# Altium schematic sheet Microcontroller.SchDoc
size A2; SheetNumber: 1; SheetTotal: 4
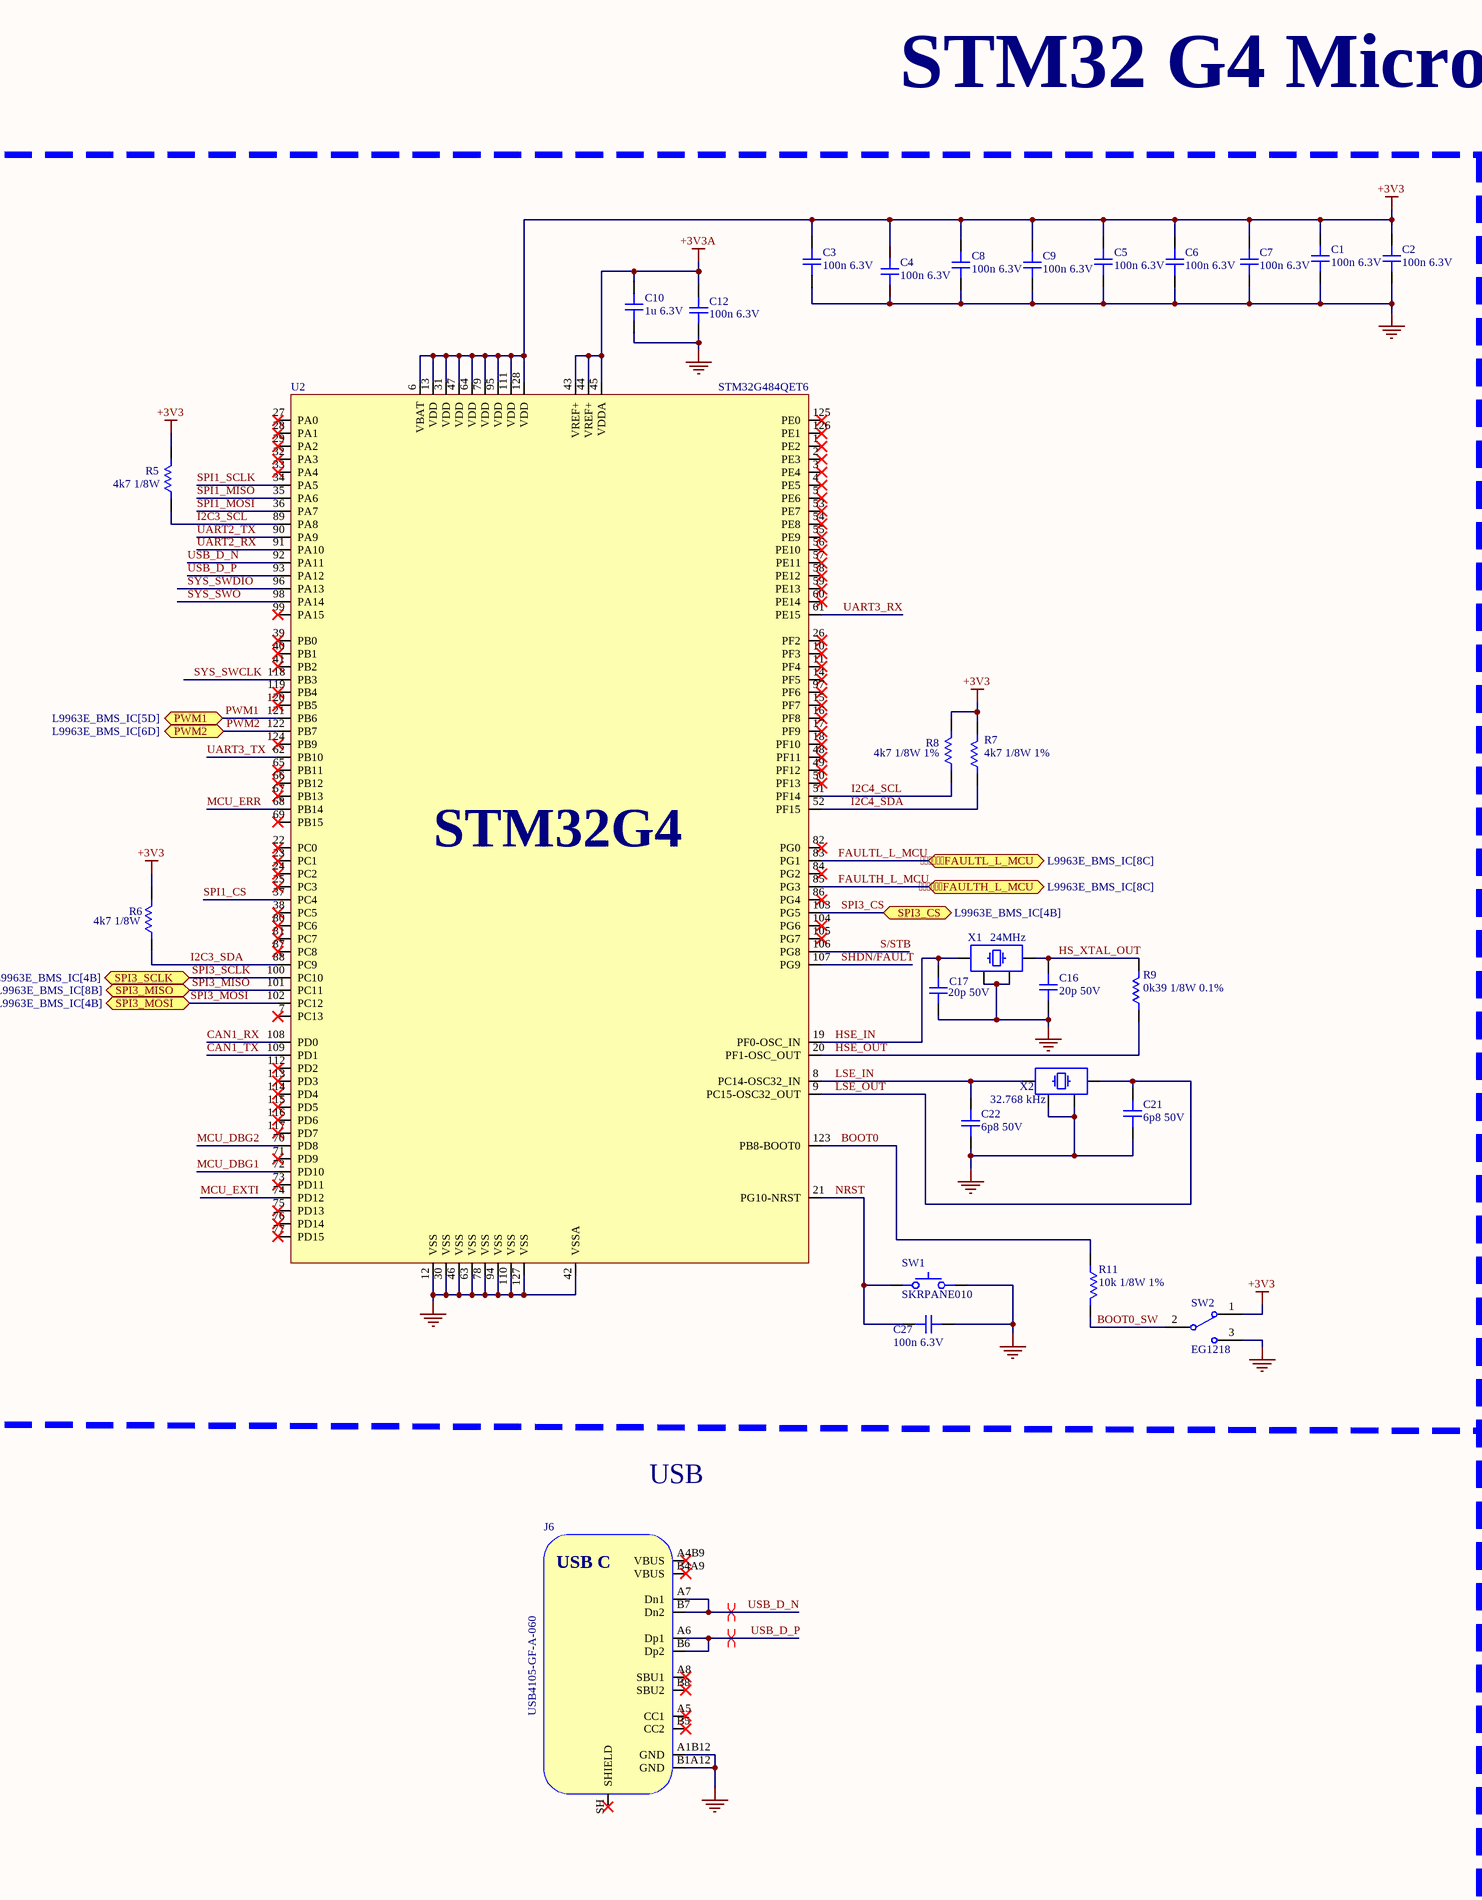
[diagram p0: Microcontroller.SchDoc, left]
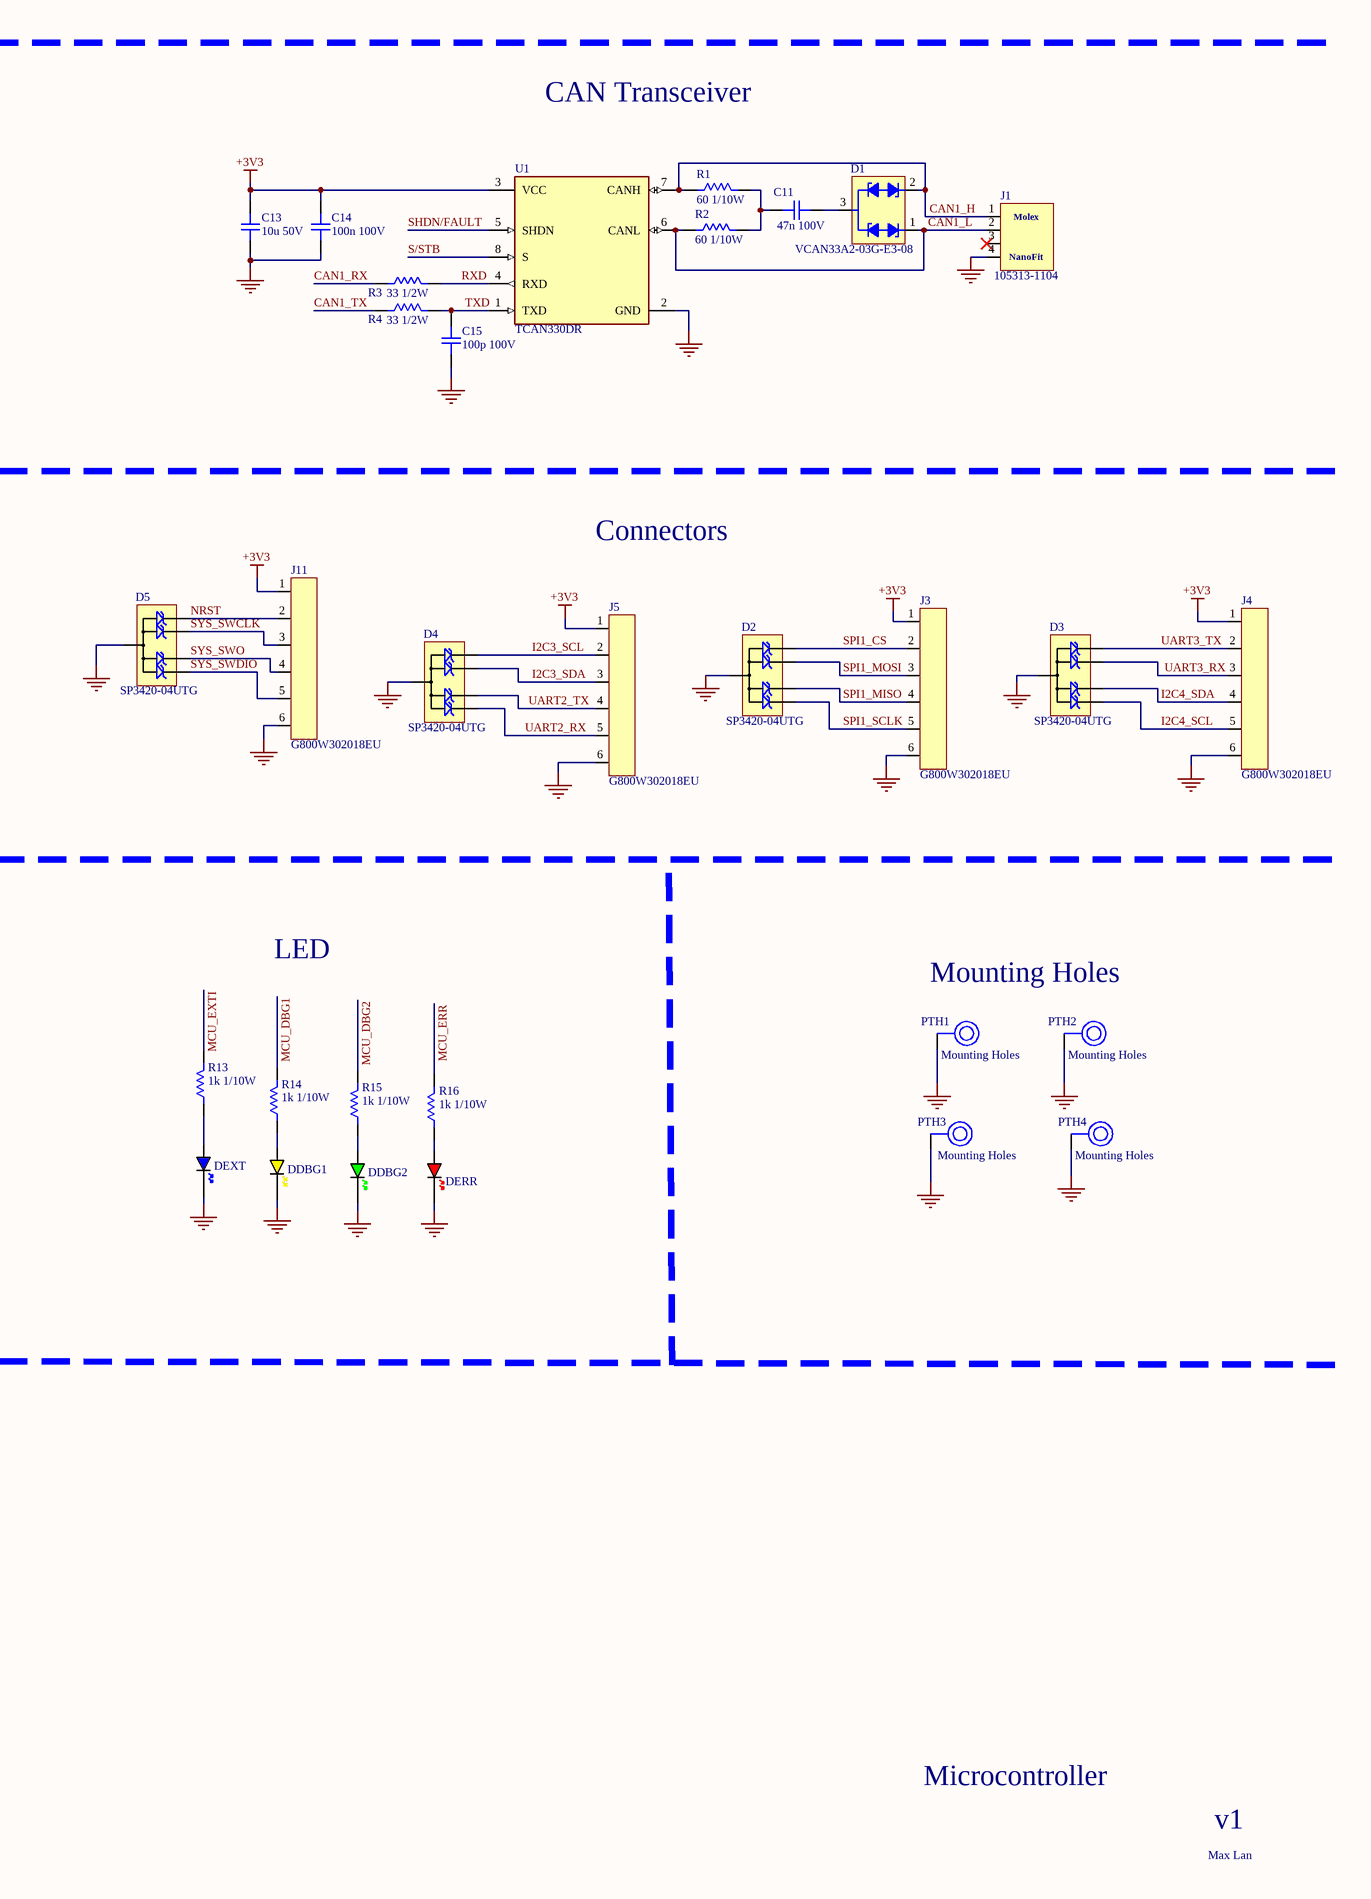
[diagram p1: Microcontroller.SchDoc, right]

## Parts
C1  100n 6.3V  [CAP_0603]
C2  100n 6.3V  [CAP_0603]
C3  100n 6.3V  [CAP_0603]
C4  100n 6.3V  [CAP_0603]
C5  100n 6.3V  [CAP_0603]
C6  100n 6.3V  [CAP_0603]
C7  100n 6.3V  [CAP_0603]
C8  100n 6.3V  [CAP_0603]
C9  100n 6.3V  [CAP_0603]
C10  1u 6.3V  [CAP_0603]
C11  47n 100V  [CAP_0603]
C12  100n 6.3V  [CAP_0603]
C13  10u 50V  [CAP_1210]
C14  100n 100V  [CAP_0603]
C15  100p 100V  [CAP_0603]
C16  20p 50V  [CAP_0603]
C17  20p 50V  [CAP_0603]
C21  6p8 50V  [CAP_0603]
C22  6p8 50V  [CAP_0603]
C27  100n 6.3V  [CAP_0603]
D1  VCAN33A2-03G-E3-08  [VCAN33A2-03G-E3-08]
D2  SP3420-04UTG  [uDFN-10]
D3  SP3420-04UTG  [uDFN-10]
D4  SP3420-04UTG  [uDFN-10]
D5  SP3420-04UTG  [uDFN-10]
DDBG1  YELLOW  [LED_0603_YELLOW]  (value not drawn)
DDBG2  GREEN  [LED_0603_GREEN]  (value not drawn)
DERR  RED  [LED_0603_RED]  (value not drawn)
DEXT  BLUE  [LED_0603_BLUE]  (value not drawn)
J1  105313-1104  [105313-1104]
J3  G800W302018EU  [G800W302018EU]
J4  G800W302018EU  [G800W302018EU]
J5  G800W302018EU  [G800W302018EU]
J6  USB4105-GF-A-060  [USB4105-GF-A-060]
J11  G800W302018EU  [G800W302018EU]
PTH1  Mounting Holes  [Mounting Hole]
PTH2  Mounting Holes  [Mounting Hole]
PTH3  Mounting Holes  [Mounting Hole]
PTH4  Mounting Holes  [Mounting Hole]
R1  60 1/10W  [RES_0201]
R2  60 1/10W  [RES_0201]
R3  33 1/2W  [RES_1206]
R4  33 1/2W  [RES_1206]
R5  4k7 1/8W  [RES_0603]
R6  4k7 1/8W  [RES_0603]
R7  4k7 1/8W 1%  [RES_0603]
R8  4k7 1/8W 1%  [RES_0603]
R9  0k39 1/8W 0.1%  [RES_0603]
R11  10k 1/8W 1%  [RES_0603]
R13  1k 1/10W  [RES_0603]
R14  1k 1/10W  [RES_0603]
R15  1k 1/10W  [RES_0603]
R16  1k 1/10W  [RES_0603]
SW1  SKRPANE010  [SKRPANE010]
SW2  EG1218  [ESWI-EG1218_V]
U1  TCAN330DR  [FP-D0008A-IPC_A]
U2  STM32G484QET6  [LQFP-128]
X1  24MHz  [XTAL_3225]
X2  32.768 kHz  [G43270009]

## Ports
FAULTH_L_MCU (bidir, see L9963E_BMS_IC[8C]), FAULTL_L_MCU (bidir, see L9963E_BMS_IC[8C]), PWM1 (bidir, see L9963E_BMS_IC[5D]), PWM2 (bidir, see L9963E_BMS_IC[6D]), SPI3_CS (bidir, see L9963E_BMS_IC[4B]), SPI3_MISO (bidir, see L9963E_BMS_IC[8B]), SPI3_MOSI (bidir, see L9963E_BMS_IC[4B]), SPI3_SCLK (bidir, see L9963E_BMS_IC[4B])

## Nets
+3V3: C1.2 C2.2 C3.2 C4.2 C5.2 C6.2 C7.2 C8.2 C9.2 C13.2 C14.2 J3.1 J4.1 J5.1 J11.1 R5.2 R6.2 R7.2 R8.2 SW2.1 U1.3(VCC) U2.6(VBAT) U2.13(VDD) U2.31(VDD) U2.47(VDD) U2.64(VDD) U2.79(VDD) U2.95(VDD) U2.111(VDD) U2.128(VDD)
+3V3A: C10.2 C12.2 U2.43(VREF+) U2.44(VREF+) U2.45(VDDA)
GND: C1.1 C2.1 C3.1 C4.1 C5.1 C6.1 C7.1 C8.1 C9.1 C10.1 C12.1 C13.1 C14.1 C15.1 C16.1 C17.1 C21.2 C22.1 C27.1 D2.38(GND) D3.38(GND) D4.38(GND) D5.38(GND) DDBG1.K DDBG2.K DERR.K DEXT.K J1.4 J3.6 J4.6 J5.6 J6.A1B12(GND) J6.B1A12(GND) J11.6 PTH1.1 PTH2.1 PTH3.1 PTH4.1 SW1.34 SW2.3 U1.2(GND) U2.12(VSS) U2.30(VSS) U2.42(VSSA) U2.46(VSS) U2.63(VSS) U2.78(VSS) U2.94(VSS) U2.110(VSS) U2.127(VSS) X1.2 X1.4 X2.2 X2.4
BOOT0: R11.1 U2.123(PB8-BOOT0)
BOOT0_SW: R11.2 SW2.2(COM)
CAN1_H: D1.2 J1.1 R1.1 U1.7(CANH)
CAN1_L: D1.1 J1.2 R2.1 U1.6(CANL)
CAN1_RX: R3.1 U2.108(PD0)
CAN1_TX: R4.1 U2.109(PD1)
FAULTH_L_MCU: U2.85(PG3) ; port FAULTH_L_MCU
FAULTL_L_MCU: U2.83(PG1) ; port FAULTL_L_MCU
HS_XTAL_OUT: C16.2 R9.2 X1.3
HSE_IN: C17.2 U2.19(PF0-OSC_IN) X1.1
HSE_OUT: R9.1 U2.20(PF1-OSC_OUT)
I2C3_SCL: D4.110 J5.2 R5.1 U2.89(PA8)
I2C3_SDA: D4.29 J5.3 R6.1 U2.88(PC9)
I2C4_SCL: D3.56 J4.5 R8.1 U2.51(PF14)
I2C4_SDA: D3.47 J4.4 R7.1 U2.52(PF15)
LSE_IN: C22.2 U2.8(PC14-OSC32_IN) X2.1
LSE_OUT: C21.1 U2.9(PC15-OSC32_OUT) X2.3
MCU_DBG1: R14.2 U2.72(PD10)
MCU_DBG2: R15.2 U2.70(PD8)
MCU_ERR: R16.2 U2.68(PB14)
MCU_EXTI: R13.2 U2.74(PD12)
NRST: C27.2 D5.110 J11.2 SW1.12 U2.21(PG10-NRST)
PWM1: U2.121(PB6) ; port PWM1
PWM2: U2.122(PB7) ; port PWM2
RXD: R3.2 U1.4(RXD)
S/STB: U1.8(S) U2.106(PG8)
SHDN/FAULT: U1.5(SHDN) U2.107(PG9)
SPI1_CS: D2.110 J3.2 U2.37(PC4)
SPI1_MISO: D2.47 J3.4 U2.35(PA6)
SPI1_MOSI: D2.29 J3.3 U2.36(PA7)
SPI1_SCLK: D2.56 J3.5 U2.34(PA5)
SPI3_CS: U2.103(PG5) ; port SPI3_CS
SPI3_MISO: U2.101(PC11) ; port SPI3_MISO
SPI3_MOSI: U2.102(PC12) ; port SPI3_MOSI
SPI3_SCLK: U2.100(PC10) ; port SPI3_SCLK
SYS_SWCLK: D5.29 J11.3 U2.118(PB3)
SYS_SWDIO: D5.56 J11.5 U2.96(PA13)
SYS_SWO: D5.47 J11.4 U2.98(PA14)
TXD: C15.2 R4.2 U1.1(TXD)
UART2_RX: D4.56 J5.5 U2.91(PA10)
UART2_TX: D4.47 J5.4 U2.90(PA9)
UART3_RX: D3.29 J4.3 U2.61(PE15)
UART3_TX: D3.110 J4.2 U2.62(PB10)
USB_D_N: J6.A7(Dn1) J6.B7(Dn2) U2.92(PA11)
USB_D_P: J6.A6(Dp1) J6.B6(Dp2) U2.93(PA12)
NetC11_1: C11.1 R1.2 R2.2
NetC11_2: C11.2 D1.3
NetDDBG1_A: DDBG1.A R14.1
NetDDBG2_A: DDBG2.A R15.1
NetDERR_A: DERR.A R16.1
NetDEXT_A: DEXT.A R13.1

Not connected (* = marked no-connect by the designer): J1 3*; J6 A4B9(VBUS)* A5(CC1)* A8(SBU1)* B4A9(VBUS)* B5(CC2)* B8(SBU2)* SH(SHIELD)*; U2 1(PE2)* 2(PE3)* 3(PE4)* 4(PE5)* 5(PE6)* 7(PC13)* 10(PF3)* 11(PF4)* 14(PF5)* 15(PF7)* 16(PF8)* 17(PF9)* 18(PF10)* 22(PC0)* 23(PC1)* 24(PC2)* 25(PC3)* 26(PF2)* 27(PA0)* 28(PA1)* 29(PA2)* 32(PA3)* 33(PA4)* 38(PC5)* 39(PB0)* 40(PB1)* 41(PB2)* 48(PF11)* 49(PF12)* 50(PF13)* 53(PE7)* 54(PE8)* 55(PE9)* 56(PE10)* 57(PE11)* 58(PE12)* 59(PE13)* 60(PE14)* 65(PB11)* 66(PB12)* 67(PB13)* 69(PB15)* 71(PD9)* 73(PD11)* 75(PD13)* 76(PD14)* 77(PD15)* 80(PC6)* 81(PC7)* 82(PG0)* 84(PG2)* 86(PG4)* 87(PC8)* 97(PF6)* 99(PA15)* 104(PG6)* 105(PG7)* 112(PD2)* 113(PD3)* 114(PD4)* 115(PD5)* 116(PD6)* 117(PD7)* 119(PB4)* 120(PB5)* 124(PB9)* 125(PE0)* 126(PE1)*

## Layout directives
differential pair; differential pair class USB_DIFF_PAIR: USB_D_N, USB_D_P

## Notes on the sheet
- STM32 G4 Microcontroller
- CAN Transceiver
- Connectors
- LED
- Mounting Holes
- USB
- Microcontroller
- Max Lan
- v1
- (in symbol 105313-1104) NanoFit
- (in symbol STM32G484QET6) STM32G4
- (in symbol USB4105-GF-A-060) USB C

## Library data of the parts
C1-C9 C12 C27 = KGM15AR70J104KT: Multilayer Ceramic Capacitors MLCC - SMD/SMT 6.3V .1uF X7R 0603 10%; Manufacturer: KYOCERA AVX; Rating: 100n 6.3V 100n 0603; Manufacturer Part Number: KGM15AR70J104KT; Distributor Link: https://ele.kyocera.com/assets/products/capacitor/KGM_Series_e.pdf; LCSC: N/A; Dielectric: *
C10 = C0603X105K9RACAUTO: Multilayer Ceramic Capacitors MLCC - SMD/SMT 6.3 Vo 1 uF 0603 X7R 10 % AECQ200; Manufacturer: KEMET; Rating: 1u 6.3V X7R 0603; Manufacturer Part Number: C0603X105K9RACAUTO; Distributor Link: https://www.mouser.tw/datasheet/3/72/1/C0603X105K9RACAUTO.pdf; LCSC: N/A; Dielectric: *
C11 = C0603C473J1RACTU: Multilayer Ceramic Capacitors MLCC - SMD/SMT 100V 0.047uF X7R 0603 5%; Manufacturer: KEMET; Rating: 47nF 100V X7R 0603 5%; Manufacturer Part Number: C0603C473J1RACTU; Distributor Link: https://www.mouser.tw/en/ProductDetail/KEMET/C0603C473J1RACTU?qs=sGAEpiMZZMvsSlwiRhF8qpRMYGxmftL79YZ310PzB5U%3D; Datasheet Link: https://www.mouser.tw/datasheet/3/72/1/C0603C473J1RACTU.pdf; Dielectric: *
C13 = KAF32LR71H106KL: Multilayer Ceramic Capacitors MLCC - SMD/SMT 50V 10uF X7R 1210 10 % AEC-Q200 FLEXITERM; Manufacturer: KYOCERA AVX; Rating: 10uF 50V 1210 X7R 10%; Manufacturer Part Number: KAF32LR71H106KL; Distributor Link: https://www.mouser.tw/en/ProductDetail/KYOCERA-AVX/KAF32LR71H106KL?qs=sGAEpiMZZMsh%252B1woXyUXj17cMikWvs6%2F%252Bex2HAbQHVc%3D; Datasheet Link: https://www.mouser.tw/datasheet/3/5926/1/AutoMLCCKAF.pdf; Dielectric: *
C14 = MAJCH168BB7104KTEA01: Multilayer Ceramic Capacitors MLCC - SMD/SMT 100V 0.1uF 0603 X7R 10% AECQ2; Manufacturer: TAIYO YUDEN; Rating: 100nF 100V X7R 0603 10%; Manufacturer Part Number: MAJCH168BB7104KTEA01; Distributor Link: https://www.mouser.tw/en/ProductDetail/TAIYO-YUDEN/MAJCH168BB7104KTEA01?qs=ZcfC38r4PovaTBrG0IdezQ%3D%3D; Datasheet Link: https://www.mouser.com/catalog/specsheets/TAIYO_YUDEN_03-08-2024_MAJCH168BB7104KTEA01_SS.pdf?_gl=1*17qbpp1*_gcl_aw*R0NMLjE3ODUyMjg2NDkuQ2p3S0NBandwcUhUQmhBY0Vpd0FqMkFmdXJYOV9OUy1CV0xFSmd6T0FaYy1HZXR1bHVfaUZmaHVzRkI2bHhkODVUMjVSNlJWbnBOUkFob0NEdHNRQXZEX0J3RQ..*_gcl_au*MTM0NzYwMzc0Mi4xNzgyNDQ3MDMwLjE4MDQ0Nzg2ODUuMTc4NTI5MDg4OS4xNzg1MjkxOTE2LjE1NDk0Mzk5MTcuMTc4NTIxODYwOC4xNzg1MjkxOTE2*_ga*MTg5NTU5OTIyLjE3ODI0NDcwMzM.*_ga_15W4STQT4T*czE3ODUyODM3NTgkbzk5JGcxJHQxNzg1MjkxOTI1JGo0MiRsMCRoMA..; Dielectric: *
C15 = KGM15AR72A101JT: Multilayer Ceramic Capacitors MLCC - SMD/SMT 100V 100pF X7R 0603 5%; Manufacturer: KYOCERA AVX; Rating: 100pF 100V X7R 0603 5%; Manufacturer Part Number: KGM15AR72A101JT; Distributor Link: https://ele.kyocera.com/assets/products/capacitor/KGM_Series_e.pdf; Datasheet Link: https://www.mouser.tw/en/ProductDetail/KYOCERA-AVX/KGM15AR72A101JT?qs=sGAEpiMZZMvsSlwiRhF8qrQG6leidpLjMVa2%2F5XxVbDE2R%2F9vaQftg%3D%3D; Dielectric: *
C16 C17 = C0603C200J5RACTU: Multilayer Ceramic Capacitors MLCC - SMD/SMT 50V 20pF 5% X7R 0603; Manufacturer: KEMET; Rating: 20p 50V X7R 0603; Manufacturer Part Number: Multilayer Ceramic Capacitors MLCC - SMD/SMT 50V 20pF 5% X7R 0603; Distributor Link: https://www.mouser.tw/datasheet/3/72/1/KEM_C1002_X7R_SMD.pdf; LCSC: N/A; Dielectric: *
C21 C22 = 06035C6R8KAT2A: Multilayer Ceramic Capacitors MLCC - SMD/SMT T101 COMMERCIAL; Manufacturer: KYOCERA AVX; Rating: 6.8pF 50VDC X7R 10% 0603; Manufacturer Part Number: 06035C6R8KAT2A; Distributor Link: https://www.mouser.tw/datasheet/3/5926/1/X7RDielectric.pdf; LCSC: N/A; Dielectric: *
D1 = VCAN33A2-03G-E3-08: ESD Protection Diodes / TVS Diodes 9.5pF 33V SOT-323; Manufacturer Name: Vishay Semicondutors; ComponentLink1Description: Datasheet Link; ComponentLink1URL: https://www.vishay.com/doc?86152; ComponentLink2Description: Distributor Link; ComponentLink2URL: https://www.mouser.tw/en/ProductDetail/Vishay-Semiconductors/VCAN33A2-03G-E3-08?qs=wnTfsH77Xs51hWQib6XZOg%3D%3D; Ratings: 9.5pF 33V
D2-D5 = SP3420-04UTG: TVS Diode Array Low Capacitance ESD Protection 4-Channel (Vwork=3V3, Vclamp=6V); Manufacturer: Littelfuse; Manufacturer Part Number: SP3420-04UTG
DDBG1 = LED_0603_YELLOW: LED 0603 YELLOW SMD
DDBG2 = LED_0603_GREEN: LED 0603 GREEN SMD
DERR = LED_0603_RED: LED 0603 RED SMD
DEXT = LED_0603_BLUE: LED 0603 BLUE SMD
J1 = 105313-1104: Nano-Fit Right-Angle Header, Through Hole, 2.50mm Pitch, Single Row, 2 Circuits, Tin (Sn) Plating, Black, Glow-Wire Capable, Tray; Manufacturer: Molex; Manufacturer Part Number: 105313-1104
J3-J5 J11 = G800W302018EU: Pin Header 6 Position 2.54mm Pitch; Manufacturer: Amphenol; Manufacturer Part Number: G800W302018EU
J6 = USB4105-GF-A-060: USB Connector Type C SMT 12 Pin; Manufacturer: GCT; Manufacturer Part Number: USB4105-GF-A-060; Distributor Link: https://eu.mouser.com/ProductDetail/GCT/USB4105-GF-A-060?qs=QNEnbhJQKvY2mocwNJzgfA%3D%3D
PTH1-PTH4 = Mounting Holes: I'm so sick of having to manually make these everytime with a different size, and how in the world do do I make one like Phil's Lab with Gnd vias around it?
R1 R2 = RK73H1HRTTCM60R4F: Thick Film Resistors - SMD; Manufacturer: KOA Speer; Values: 60ohm 1/10W 1% 0201; Manufacturer Part Number: RK73H1HRTTCM60R4F; Distributor Link: https://www.mouser.tw/en/ProductDetail/KOA-Speer/RK73H1HRTTCM60R4F?qs=sGAEpiMZZMvdGkrng054t2cqbZCzJY7NpUeVphkOANR%252BH8AfE6cgtQ%3D%3D; Datasheet Link: https://www.koaspeer.com/pdfs/RK73-RT.pdf
R3 R4 = SR1206FR-7W33RL: Thick Film Resistors - SMD 33 Ohms 1/2 W 1206 1 % AEC-Q200; Manufacturer: YAGEO; Values: 33ohm 1/2W 1205 1%; Manufacturer Part Number: SR1206FR-7W33RL; Distributor Link: https://www.mouser.tw/en/ProductDetail/YAGEO/SR1206FR-7W33RL?qs=1mbolxNpo8dtzpgXLPcQnA%3D%3D; Datasheet Link: https://www.mouser.tw/datasheet/3/508/1/PYu-SR_20105_RoHS_L_12.pdf
R5-R8 = CRCW06034K70FKEA: Thick Film Resistors - SMD 1/8 Watt 4.7Kohms 1%; Manufacturer: Vishay; Values: 4.7k 1% 1/8W 0603; Manufacturer Part Number: CRCW06034K70FKEA; Distributor Link: https://www.vishay.com/docs/20035/dcrcwe3.pdf
R9 = ERA-3VEB3900V: Thin Film Resistors - SMD 0603 0.1% 390ohm 25ppm SMD; Manufacturer: Panasonic; Ratings: 390ohm 0603 0.1% 1/8W; Manufacturer Part Number: ERA-3VEB3900V; Distributor Link: https://industrial.panasonic.com/cdbs/www-data/pdf/RDM0000/RDM0000C331.pdf; LCSC: N/A
R11 = CRCW060310K0FKEI: Thick Film Resistors - SMD 10K OHM 1%; Manufacturer: Vishay; Value: 10k 1% 1/8W 0603; Manufacturer Part Number: CRCW060310K0FKEI; Distributor Link: https://www.vishay.com/docs/20035/dcrcwe3.pdf
R13-R16 = CR0603-FX-1001EPF: Thick Film Resistors - SMD Res 0603 1k 1% 100mW TC100 low lead; Manufacturer: Bourns; Values: 1k 1% 1/10W 0603; Manufacturer Part Number: CR0603-FX-1001EPF; Distributor Link: https://www.mouser.tw/en/ProductDetail/Bourns/CR0603-FX-1001EPF?qs=sGAEpiMZZMvdGkrng054t2cqbZCzJY7NyLPI0qsjVVoXr8t57oNyzw%3D%3D; Datasheet Link: https://www.mouser.tw/datasheet/3/40/1/CR-PF.pdf
SW1 = SKRPANE010: Tactile Switch SMD SPST; Manufacturer: Alps Alpine; Manufacturer Part Number: SKRPANE010
SW2 = CMP-1696-00002-1: Slide Switch, 500 V, -20 to 70 degC, 3-Pin THD, RoHS; Case\Package: SOT-23-5; Output Current: 150 mA; Nominal Output Voltage: 3.3 V; Max Power Dissipation: 250 mW; Min Input Voltage: 4.3 V; Outputs: 1; Max Input Voltage: 8 V; Dropout Voltage: 300 mV; PackageDescription: 3-Pin Through Hole Device, Body 11.6 x 4 mm, Pitch 2.5 mm; ComponentLink1URL: http://www.e-switch.ch/en/; RoHSCompliant: true; Length: 3 mm; ComponentLink1Description: Manufacturer URL; Power Rating: 250 mW; Mount: Surface Mount; Max Operating Temperature: 85 degC; REACH SVHC: No SVHC; Radiation Hardening: No; Height: 1.3 mm; Pins: 5; Max Ouput Current: 150 mA; Output Voltage: 3.3 V; Width: 1.8 mm; Package Quantity: 3000; ComponentLink2URL: https://www.e-switch.com/system/asset/product_line/data_sheet/119/EG.pdf; Min Operating Temperature: -40 degC; ComponentLink2Description: Datasheet; DatasheetVersion: Oct-15; PackageReference: EG1218; Packaging: Tape and Reel
U1 = CMP-04872-000104-1: IC TRANSCEIVER 1/1 8SOIC; Data Rate: 1Mbps; RoHS Compliant: Yes; Case/Package: SOIC; Mount: Surface Mount; Number of Pins: 8; Packaging: Cut Tape; Max Operating Temperature: 125°C; Lead Free: Lead Free; Min Operating Temperature: -40°C
U2 = STM32G484QET6: STM32G4 Microcontroller LQFP-128 170 MHz 107 I/O; Manufacturer: STMicroelectronics; Manufacturer Part Number: STM32G484QET6
X1 = TSX-3225_24.0000MF15X-AC: Crystal SMD 24MHz 10PPM 7pF 3225; Manufacturer: Epson; Manufacturer Part Number: TSX-3225 24.0000MF15X-AC
X2 = G43270009: Crystals Crystal Plastic SMD8038 T&R 3K. / 32.768 kHz; Load Capacitance: 8pF; Tolerance: 10 PPM; Distributor Link: *; Frequency: 32.768 kHz